# Altium project FAN7688.PrjPCB
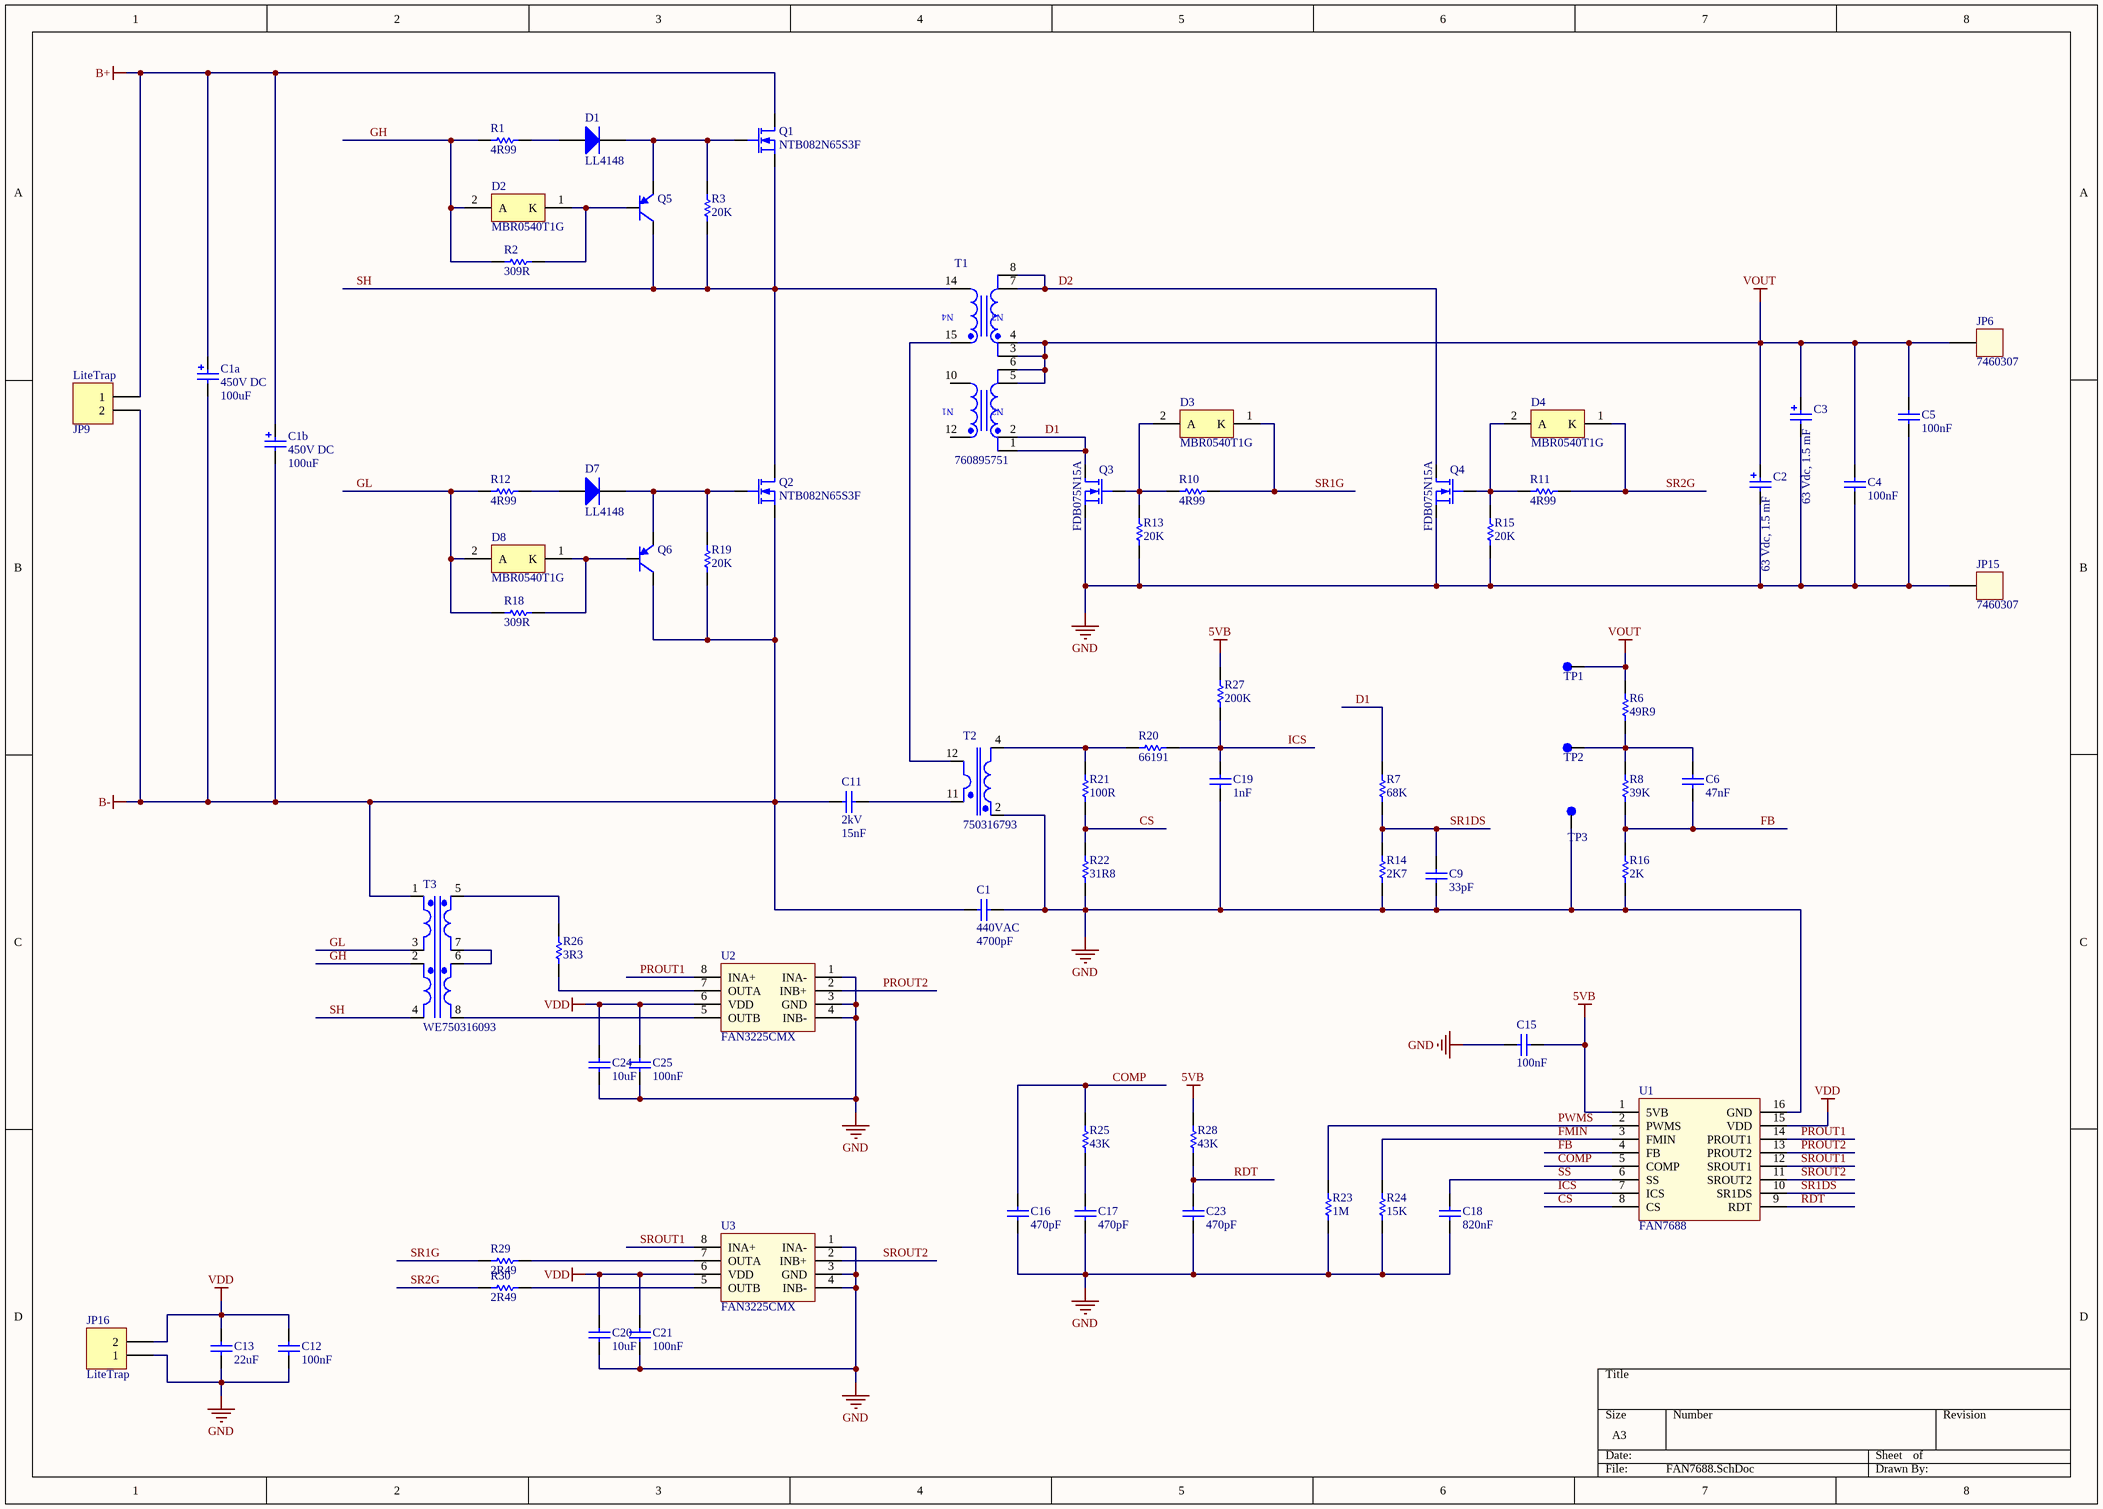
[diagram p0: FAN7688.SchDoc]
1 sheet, 73 parts. Net scope: global (net labels, ports and power ports of the same name join across sheets).
Board file: FAN7688.PcbDoc

## Sheet FAN7688.SchDoc
size A3

### Parts
C1  value 4700pF  Voltage: 440VAC  [CAP_VY2472M49Y5US63V7]  (hidden comment: VY2472M49Y5US63V7)
C1a  value 100uF  Rated Voltage: 450V DC  [WCAP-AT1H_16x35.5x7.5]  (hidden comment: 860241480001)
C1b  value 100uF  Rated Voltage: 450V DC  [WCAP-AT1H_16x35.5x7.5]  (hidden comment: 860241480001)
C2  63 Vdc, 1.5 mF  [WCAP-ATG5_18x31.5x7.5]
C3  63 Vdc, 1.5 mF  [WCAP-ATG5_18x31.5x7.5]
C4  value 100nF  [CAPC1206(3216)75_L]  (hidden comment: CAP)
C5  value 100nF  [CAPC1206(3216)75_L]  (hidden comment: CAP)
C6  value 47nF  [CAPC0805(2012)75_L]  (hidden comment: CAP)
C9  value 33pF  [CAPC0805(2012)75_L]  (hidden comment: CAP)
C11  value 15nF  Voltage: 2kV  [CAP_RM15_W9L18]  (hidden comment: B32672L8153J000)
C12  value 100nF  [CAPC0805(2012)75_L]  (hidden comment: CAP)
C13  value 22uF  [CAPC1206(3216)75_L]  (hidden comment: CAP)
C15  value 100nF  [CAPC0805(2012)75_L]  (hidden comment: CAP)
C16  value 470pF  [CAPC0805(2012)75_L]  (hidden comment: CAP)
C17  value 470pF  [CAPC0805(2012)75_L]  (hidden comment: CAP)
C18  value 820nF  [CAPC0805(2012)75_L]  (hidden comment: CAP)
C19  value 1nF  [CAPC0805(2012)75_L]  (hidden comment: CAP)
C20  value 10uF  [CAPC0805(2012)75_L]  (hidden comment: CAP)
C21  value 100nF  [CAPC0805(2012)75_L]  (hidden comment: CAP)
C23  value 470pF  [CAPC0805(2012)75_L]  (hidden comment: CAP)
C24  value 10uF  [CAPC0805(2012)75_L]  (hidden comment: CAP)
C25  value 100nF  [CAPC0805(2012)75_L]  (hidden comment: CAP)
D1  LL4148  [DIOD-SOD-80]
D2  MBR0540T1G  [ONSC-SOD-123-2-425-04_V]
D3  MBR0540T1G  [ONSC-SOD-123-2-425-04_V]
D4  MBR0540T1G  [ONSC-SOD-123-2-425-04_V]
D7  LL4148  [DIOD-SOD-80]
D8  MBR0540T1G  [ONSC-SOD-123-2-425-04_V]
JP6  7460307  [7460307]
JP9  LiteTrap  [CONN_MiniLite]
JP15  7460307  [7460307]
JP16  LiteTrap  [CONN_MiniLite]
Q1  NTB082N65S3F  [D2PAK_L]
Q2  NTB082N65S3F  [D2PAK_L]
Q3  FDB075N15A  [D2PAK_L]
Q4  FDB075N15A  [D2PAK_L]
Q5  ZXTP19060CFFTA  [DIOD-SOT23F-3_V]  (value not drawn)
Q6  ZXTP19060CFFTA  [DIOD-SOT23F-3_V]  (value not drawn)
R1  value 4R99  [RESC0805(2012)_L]  (hidden comment: RES)
R2  value 309R  [RESC0805(2012)_L]  (hidden comment: RES)
R3  value 20K  [RESC0805(2012)_L]  (hidden comment: RES)
R6  value 49R9  [RESC0805(2012)_L]  (hidden comment: RES)
R7  value 68K  [RESC0805(2012)_L]  (hidden comment: RES)
R8  value 39K  [RESC0805(2012)_L]  (hidden comment: RES)
R10  value 4R99  [RESC0805(2012)_L]  (hidden comment: RES)
R11  value 4R99  [RESC0805(2012)_L]  (hidden comment: RES)
R12  value 4R99  [RESC0805(2012)_L]  (hidden comment: RES)
R13  value 20K  [RESC0805(2012)_L]  (hidden comment: RES)
R14  value 2K7  [RESC0805(2012)_L]  (hidden comment: RES)
R15  value 20K  [RESC0805(2012)_L]  (hidden comment: RES)
R16  value 2K  [RESC0805(2012)_L]  (hidden comment: RES)
R18  value 309R  [RESC0805(2012)_L]  (hidden comment: RES)
R19  value 20K  [RESC0805(2012)_L]  (hidden comment: RES)
R20  value 66191  [RESC0805(2012)_L]  (hidden comment: RES)
R21  value 100R  [RESC0805(2012)_L]  (hidden comment: RES)
R22  value 31R8  [RESC0805(2012)_L]  (hidden comment: RES)
R23  value 1M  [RESC0805(2012)_L]  (hidden comment: RES)
R24  value 15K  [RESC0805(2012)_L]  (hidden comment: RES)
R25  value 43K  [RESC0805(2012)_L]  (hidden comment: RES)
R26  value 3R3  [RESC0805(2012)_L]  (hidden comment: RES)
R27  value 200K  [RESC0805(2012)_L]  (hidden comment: RES)
R28  value 43K  [RESC0805(2012)_L]  (hidden comment: RES)
R29  value 2R49  [RESC0805(2012)_L]  (hidden comment: RES)
R30  value 2R49  [RESC0805(2012)_L]  (hidden comment: RES)
T1  760895751  [WE-LLCR_ETD44]
T2  750316793  [WE_750316793]
T3  WE750316093  [WE_750316093]
TP1  MECH_Testpoint  [MECH_TP_39_mil]  (value not drawn)
TP2  MECH_Testpoint  [MECH_TP_39_mil]  (value not drawn)
TP3  MECH_Testpoint  [MECH_TP_39_mil]  (value not drawn)
U1  FAN7688  [ONSC-SOEIAJ-16-966-01_L]
U2  FAN3225CMX  [SOIC8_L]
U3  FAN3225CMX  [SOIC8_L]

### Nets
5VB: C15.1 R27.2 R28.2 U1.1(5VB)
B+: C1a.1(P) C1b.1(P) JP9.1 Q1.4(D)
B-: C1.1 C1a.2(N) C1b.2(N) C11.1 JP9.2 Q2.3(S) Q6.3(C) R19.1 T3.1
GND: C1.2 C2.2(N) C3.2(N) C4.1 C5.1 C9.1 C12.1 C13.1 C15.2 C16.1 C17.1 C18.1 C19.1 C20.1 C21.1 C23.1 C24.1 C25.1 JP15.1 JP16.1 Q3.3(S) Q4.3(S) R13.1 R14.1 R15.1 R16.1 R22.1 R23.1 R24.1 T2.2 TP3.1(Pin1) U1.16(GND) U2.1(INA-) U2.3(GND) U2.4(INB-) U3.1(INA-) U3.3(GND) U3.4(INB-)
VDD: C12.2 C13.2 C20.2 C21.2 C24.2 C25.2 JP16.2 U1.15(VDD) U2.6(VDD) U3.6(VDD)
VOUT: C2.1(P) C3.1(P) C4.2 C5.2 JP6.1 R6.2 T1.3 T1.4 T1.5 T1.6 TP1.1(Pin1)
COMP: C16.2 R25.2 U1.5(COMP)
CS: R21.1 R22.2 U1.8(CS)
D1: Q3.4(D) R7.2 T1.1 T1.2
D2: Q4.4(D) T1.7 T1.8
FB: C6.1 R8.1 R16.2 U1.4(FB)
FMIN: R24.2 U1.3(FMIN)
GH: D2.2(A) R1.1 R2.2 T3.2
GL: D8.2(A) R12.1 R18.2 T3.3
ICS: C19.2 R20.2 R27.1 U1.7(ICS)
PROUT1: U1.14(PROUT1) U2.8(INA+)
PROUT2: U1.13(PROUT2) U2.2(INB+)
PWMS: R23.2 U1.2(PWMS)
RDT: C23.2 R28.1 U1.9(RDT)
SH: Q1.3(S) Q2.4(D) Q5.3(C) R3.1 T1.14 T3.4
SR1DS: C9.2 R7.1 R14.2 U1.10(SR1DS)
SR1G: D3.1(K) R10.2 R29.1
SR2G: D4.1(K) R11.2 R30.1
SROUT1: U1.12(SROUT1) U3.8(INA+)
SROUT2: U1.11(SROUT2) U3.2(INB+)
SS: C18.2 U1.6(SS)
NetC6_2: C6.2 R6.1 R8.2 TP2.1(Pin1)
NetC11_2: C11.2 T2.11
NetC17_2: C17.2 R25.1
NetD1_1: D1.1(A) R1.2
NetD1_2: D1.2(K) Q1.1(G) Q5.2(E) R3.2
NetD2_1: D2.1(K) Q5.1(B) R2.1
NetD3_2: D3.2(A) Q3.1(G) R10.1 R13.2
NetD4_2: D4.2(A) Q4.1(G) R11.1 R15.2
NetD7_1: D7.1(A) R12.2
NetD7_2: D7.2(K) Q2.1(G) Q6.2(E) R19.2
NetD8_1: D8.1(K) Q6.1(B) R18.1
NetR20_1: R20.1 R21.2 T2.4
NetR26_1: R26.1 U2.7(OUTA)
NetR26_2: R26.2 T3.5
NetR29_2: R29.2 U3.7(OUTA)
NetR30_2: R30.2 U3.5(OUTB)
NetT1_15: T1.15 T2.12
NetT3_6: T3.6 T3.7
NetT3_8: T3.8 U2.5(OUTB)

Not connected (* = marked no-connect by the designer): T1 10 12

### Notes on the sheet
- (in symbol 760895751) N4; N3; N1; N2

### Library data of the parts
C1 = CAP_VY2_4700: 4700pF ±20% 440VAC Ceramic Capacitor Y5U (E) Radial, Disc; PackageReference: THD; FARNELL: 1902233; MPN: VY2472M49Y5US63V7; DigiKey: BC2359-ND
C1a C1b = 860241480001: WCAP-AT1H Aluminum Electrolytic Capacitors, size Ф16x35.5mm, 450V DC, 100uF; ComponentLink1Description: Manufacturer; ComponentLink1URL: http://www.we-online.de; ComponentLink2Description: Datasheet; ComponentLink2URL: http://katalog.we-online.de/pbs/datasheet/860241480001.pdf; Part Number: 860241480001; Published Date: June 2017; Publisher: Wurth Elektronik; Size: Ф16x35.5mm; Life Cycle: 5000h; Operating Temperature: -25 °C up to +105 °C
C2 C3 = 860020781027: WCAP-ATG5 Aluminum Electrolytic Capacitors, 18x31.5mm, 63 Vdc, 1.5 mF; Rated Voltage: 63 Vdc; Value: 1.5 mF; ComponentLink1Description: Manufacturer; ComponentLink1URL: http://www.we-online.de; ComponentLink2Description: Datasheet; ComponentLink2URL: http://katalog.we-online.com/pbs/datasheet/860020781027.pdf; Part Number: 860020781027; Published Date: Sep. 2017; Publisher: Wurth Elektronik; Size: 18x31.5mm; Life Cycle: 2000h; Operating Temperature: -40 °C up to +105 °C
C4-C6 C9 C12 C13 C15-C21 C23-C25 = CAP: Generic capacitor non polarised
C11 = CAP_MKP_B32672L8153J000: 0.015µF Film Capacitor 700V 2000V (2kV) Polypropylene (PP), Metallized Radial; PackageReference: RM15; Farnell: 2469018; MPN: B32672L8153J000; DigiKey: 495-3234-ND
D1 D7 = DIOD_GP_LL4148: DIODE GEN PURP 100V 200MA SOD80; Code_JEDEC: SOD-80; FARNELL: 2101203; DigiKey: LL4148FSTR-ND; MPN: LL4148
D2-D4 D8 = CMP-1055-00401-1: Schottky Power Rectifier, 2-Pin SOD-123, Pb-Free, Tape and Reel; Manufacturer: On Semiconductor; IFSM Max (A): 5.5; Configuration: Single; ComponentLink1URL: http://www.onsemi.com/; ComponentLink3Description: Package Specification; RoHS: TRUE; PackageVersion: Rev. G, 10/2009; DatasheetVersion: Rev. 7; ComponentLink3URL: http://www.onsemi.com/pub_link/Collateral/425-04.PDF; Packing: Tape and Reel; ComponentLink1Description: Manufacturer URL; PackageDescription: 2-Pin SOD, Body 1.6 x 2.69 mm; PartNumber: MBR0540T1G; ComponentLink2Description: Datasheet; ComponentLink2URL: http://www.onsemi.cn/pub_link/Collateral/MBR0540T1-D.PDF; PackageReference: SOD-123-2-425-04; Mounting Technology: Surface Mount
JP6 JP15 = 7460307: REDCUBE PRESS-FIT with internal thread, two rows WP-BUTR, M4 - 6 mm; Pin Number: 8; Rated Current: 160 A; Thread Length: 6 mm; ComponentLink1Description: Manufacturer; ComponentLink1URL: http://www.we-online.de; ComponentLink2Description: Datasheet; ComponentLink2URL: http://katalog.we-online.de/em/datasheet/7460307.pdf; Part Number: 7460307; Published Date: March  2017; Publisher: Wurth Elektronik; Thread: M4
JP9 JP16 = CONN_LiteTrap_2: CONN SSL RCPT 2POS 4MM SOLDER; MPN: 104188-0210; ELFA: 43-808-61; Farnell: 2401572; DigiKey: WM10425CT-ND
Q1 Q2 = TRAN_NTB082N65S3F: N-Channel 650V 40A (Tc) 313W (Tc) Surface Mount D2PAK (TO-263); MPN: NTB082N65S3F
Q3 Q4 = TRAN_FDB075N15A: N-Channel 150V 110A (Tc) 333W (Tc) Surface Mount D2PAK (TO-263); MPN: FDB075N15A
Q5 Q6 = TRAN_ZXTP19060CFFTA: Bipolar (BJT) Transistor PNP 60V 4A 180MHz 1.5W Surface Mount SOT-23F; ComponentLink1Description: Manufacturer Link; ComponentLink1URL: http://www.fairchildsemi.com/; ComponentLink2Description: Datasheet; ComponentLink2URL: http://www.fairchildsemi.com/ds/2N%2F2N3906.pdf; MPN: ZXTP19060CFFTA
R1-R3 R6-R8 R10-R16 R18-R30 = RES: Generic resistor
T1 = 760895751: WE-LLCR Resonant Converter, size ETD44, 600uH, 27:6:6:2 , 250W; Input Voltage: 360-400 V DC; Inductance: 400uH; ComponentLink1Description: Manufacturer; ComponentLink1URL: http://www.we-online.de; ComponentLink2Description: Datasheet; ComponentLink2URL: http://katalog.we-online.de/pbs/datasheet/760895751.pdf; Part Number: 760895751; Published Date: July 2017; Publisher: Wurth Elektronik; Size: ETD44; Turns Ratio: 27:6:6:2; Output Power: 250W
T2 = TRANS_WE750316793: MID-SNS Current Sense Transformers; MPN: 750316793
T3 = TRANS_WE750316093: MID-GDT Gate Drive Transformers; MPN: 750316093
TP1-TP3 = MECH_Testpoint: Testpoint
U1 = IC-PMIC-FAN7688: Power Supply Controller Secondary-Side Controller, Synchronous Rectifier 16-SOP; MPN: FAN7688SJX
U2 U3 = IC-PMIC-FAN3225CMX: Low-Side Gate Driver IC Inverting, Non-Inverting 8-SOIC; MPN: FAN3225CMX